# EAGLE design Rev 1 (EAGLE 7.2.0)
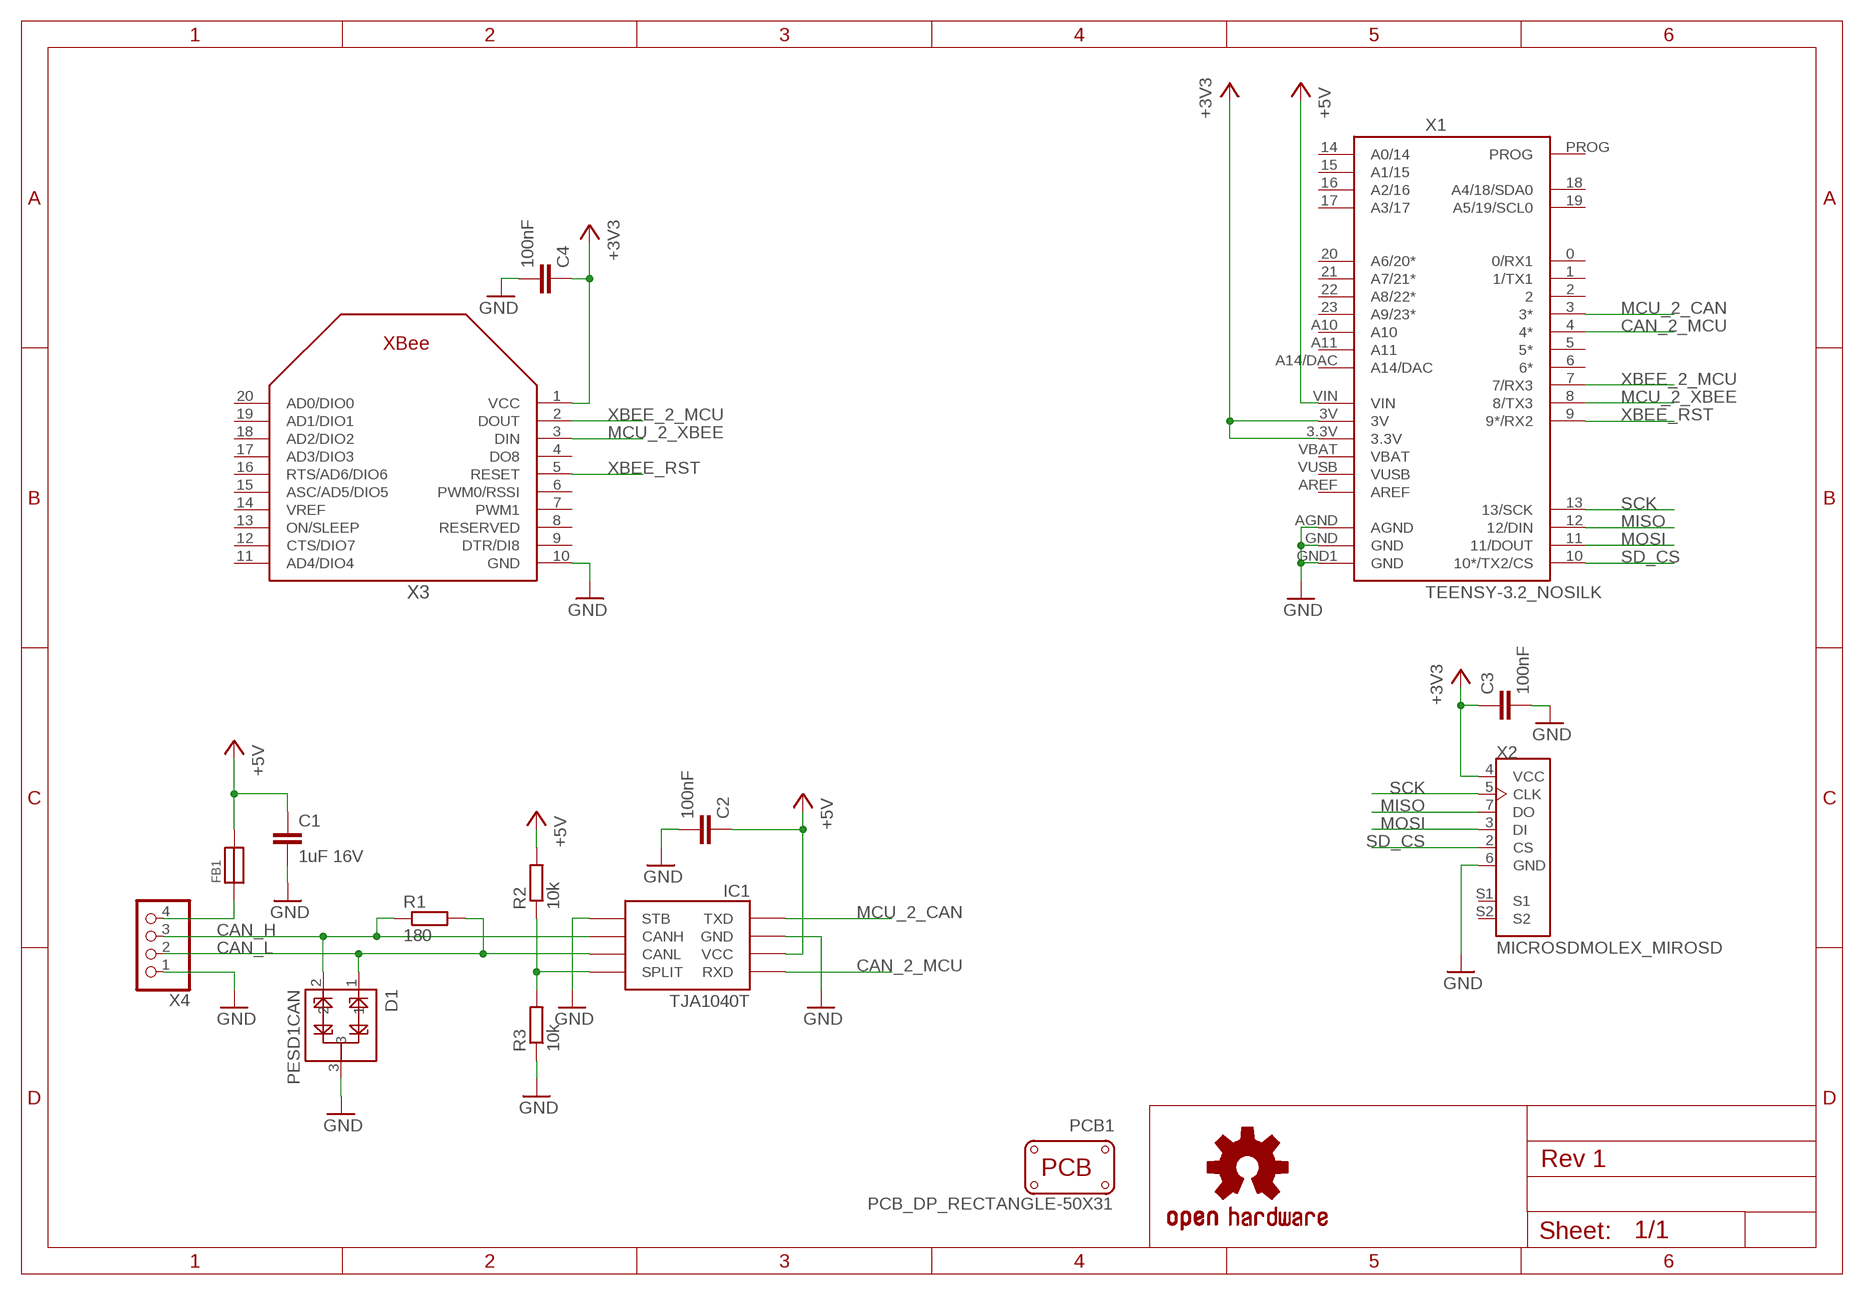
[diagram p0: schematic, sheet 1]

## Parts
C1  1uF 16V  C-EUC1206  [C1206]
C2  100nF  C-EUC0603  [C0603]
C3  100nF  C-EUC0603  [C0603]
C4  100nF  C-EUC0603  [C0603]
D1  PESD1CAN  [SOT23-3]
FB1  FERRITE  [0603]
IC1  TJA1040T  TJA1040  [SO08]
LOGO1  OSHW-LOGOM  [OSHW-LOGO-M]
PCB1  PCB_DP_RECTANGLE-50X31  [DP5031_V1]
R1  180  R-EU_R0603  [R0603]
R2  10k  R-EU_R0603  [R0603]
R3  10k  R-EU_R0603  [R0603]
X1  TEENSY-3.2_NOSILK  TEENSY-3.1NOSILK  [TEENSY-3.1_NOSILK]
X2  MICROSDMOLEX_MIROSD  [MOLEX_MICROSD]
X3  XBEE  [XBEE]
X4  JST_4PIN  [JSTPH4]

## Nets
+3V3: C3.1 C4.1 X1.3.3V X1.3V X2.4(VCC) X3.1(VCC)
+5V: C1.1 C2.1 FB1.2 IC1.3(VCC) R2.2 X1.VIN
+5V_RAW: FB1.1 X4.4
CAN_2_MCU: IC1.4(RXD) X1.4(4*)
CAN_H: D1.2 IC1.7(CANH) R1.1 X4.3
CAN_L: D1.1 IC1.6(CANL) R1.2 X4.2
GND: C1.2 C2.2 C3.2 C4.2 D1.3 IC1.2(GND) IC1.8(STB) R3.1 X1.AGND X1.GND X1.GND1(GND) X2.6(GND) X3.10(GND) X4.1
MCU_2_CAN: IC1.1(TXD) X1.3(3*)
MCU_2_XBEE: X1.8(8/TX3) X3.3(DIN)
MISO: X1.12(12/DIN) X2.7(DO)
MOSI: X1.11(11/DOUT) X2.3(DI)
N$1: IC1.5(SPLIT) R2.1 R3.2
SCK: X1.13(13/SCK) X2.5(CLK)
SD_CS: X1.10(10*/TX2/CS) X2.2(CS)
XBEE_2_MCU: X1.7(7/RX3) X3.2(DOUT)
XBEE_RST: X1.9(9*/RX2) X3.5(RESET)
Unconnected: X1.0(0/RX1) X1.1(1/TX1) X1.2 X1.5(5*) X1.6(6*) X1.14(A0/14) X1.15(A1/15) X1.16(A2/16) X1.17(A3/17) X1.18(A4/18/SDA0) X1.19(A5/19/SCL0) X1.20(A6/20*) X1.21(A7/21*) X1.22(A8/22*) X1.23(A9/23*) X1.A10 X1.A11 X1.A14/DAC X1.AREF X1.PROG X1.VBAT X1.VUSB X2.S1 X2.S2 X3.4(DO8) X3.6(PWM0/RSSI) X3.7(PWM1) X3.8(RESERVED) X3.9(DTR/DI8) X3.11(AD4/DIO4) X3.12(CTS/DIO7) X3.13(ON/SLEEP) X3.14(VREF) X3.15(ASC/AD5/DIO5) X3.16(RTS/AD6/DIO6) X3.17(AD3/DIO3) X3.18(AD2/DIO2) X3.19(AD1/DIO1) X3.20(AD0/DIO0)

## Library data of the parts
C1-C4 = rcl:C-EU: CAPACITOR, European symbol
D1 = SparkFun-DiscreteSemi:PESD1CAN: PESD1CAN is used to protect two automotive CAN bus lines from ESD.; PROD_ID: DIO-12501
FB1 = microbuilder:FERRITE: Ferrite Bead 0603 MMZ1608B121C - 120 Ohm, 600mA Ferrite Chip - Digikey: 445-2164-1-ND BK1608HW121-T - 120 Ohm, 600mA Ferrite Chip - Digikey: 587-1876-2-ND
IC1 = SparkFun-DigitalIC:TJA1040: CAN Tranceiver
LOGO1 = SparkFun-Aesthetics:OSHW-LOGO: Open Source Hardware Logo This logo indicates the piece of hardware it is found on incorporates a OSHW license and/or adheres to the definition of open source hardware found here: http://freedomdefined.org/OSHW
PCB1 = dp_devices:PCB_DP_RECTANGLE: Dangerous Prototypes Standard Rectangular PCB sizes
R1-R3 = rcl:R-EU_: RESISTOR, European symbol
X1 = SparkFun-Boards:TEENSY-3.1; SF_ID: DEV-12646
X2 = mbed-connectors:MICROSD
X3 = adafruit:XBEE
X4 = microbuilder:JST_4PIN: JST 4-Pin Right-Angle Connector 4UConnector: 17312

## Board
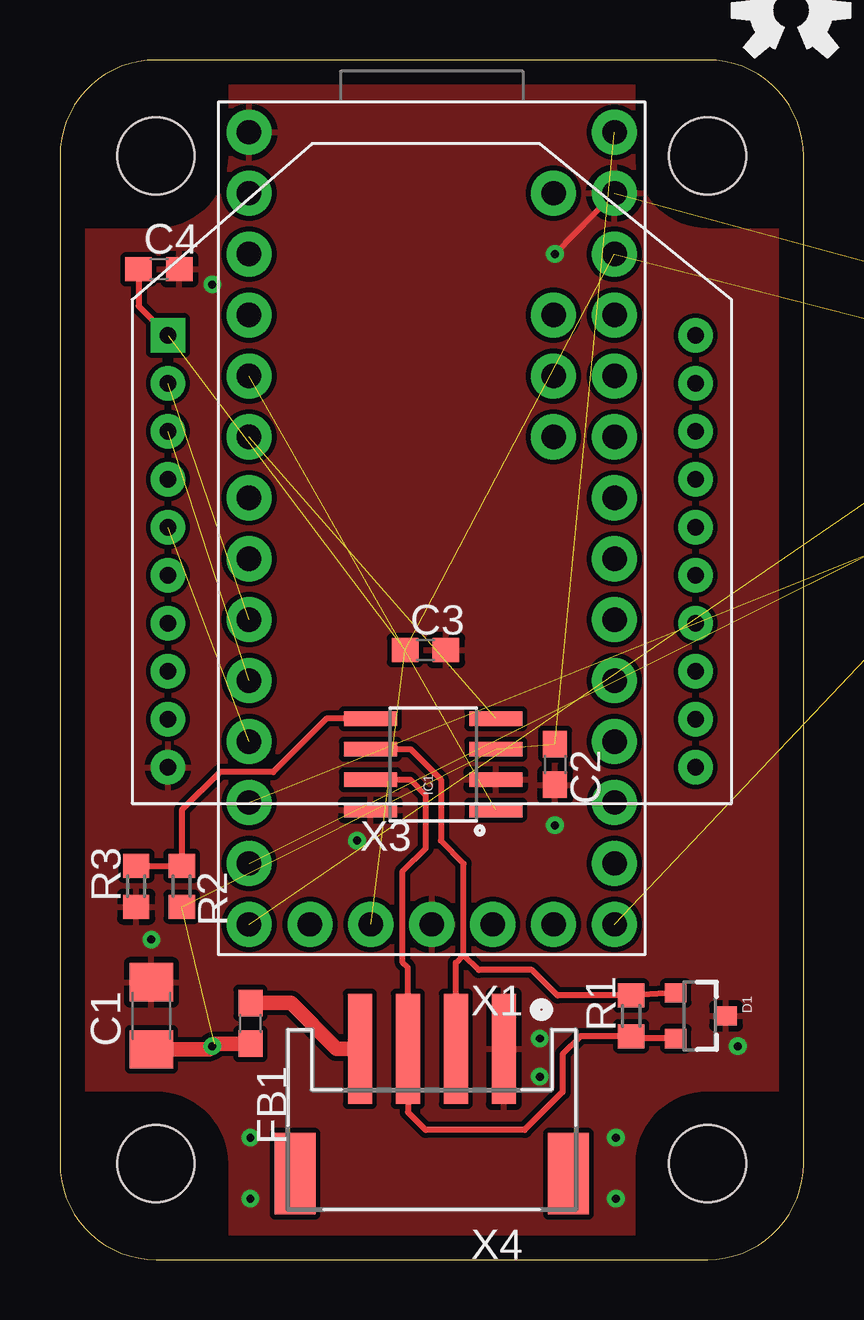
[diagram p1: board, top side]
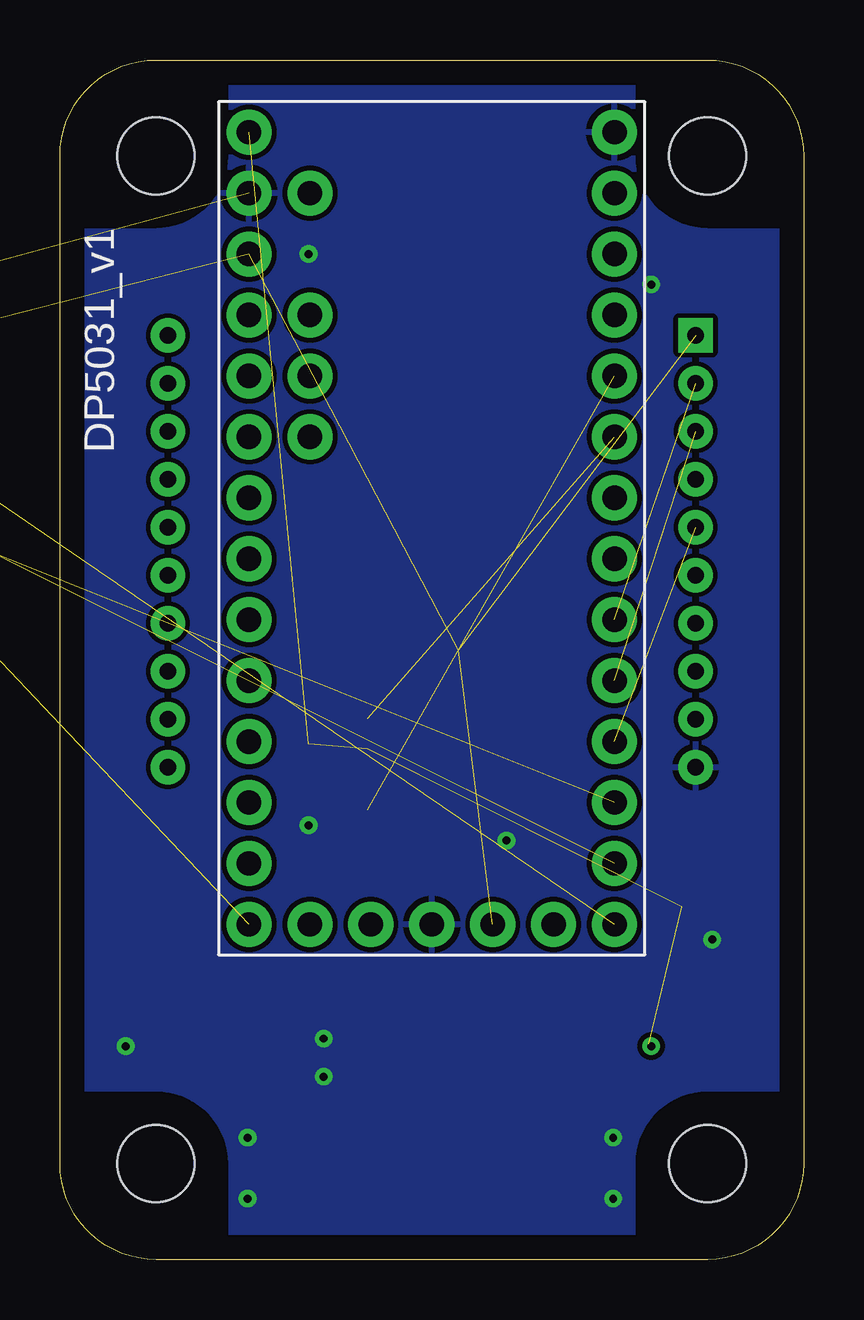
[diagram p2: board, bottom side, seen from below]

Size 31 x 50 mm. Coordinates in mm from the lower left corner, seen from the top.
Copper layers (1*16): Top 0.035mm / dielectric 1.5mm / Bottom 0.035mm
Design rules "default": minimum track width 10mil, minimum drill 24mil, track to track 8mil, track to pad 8mil, pad to pad 8mil, via to via 8mil, smd to smd 8mil, copper to edge 40mil, drill to drill 8mil, minimum pad ring 10mil, minimum via ring 8mil, stop-mask expansion 4mil, vias tented up to drill 0mil, thermal gap 10mil

### Footprints (pad centres in the part's own frame; a part is rotated, then mirrored left to right if it is on the bottom)
C1206 = smd 1.6 x 1.8: 1 -1.4,0; 2 1.4,0
C0603 = smd 1.1 x 1: 1 -0.85,0; 2 0.85,0
SOT23-3 = smd 0.8 x 0.9: 1 -0.95,-1; 2 0.95,-1; 3 0,1.1
0603 = smd 1.1 x 1: 1 -0.85,0; 2 0.85,0
SO08 = smd 0.61 x 2.21: 1 -1.905,-2.616; 2 -0.635,-2.616; 3 0.635,-2.616; 4 1.905,-2.616; 5 1.905,2.616; 6 0.635,2.616; 7 -0.635,2.616; 8 -1.905,2.616
DP5031_V1 = hole 3.2: 4,4; 46,4; 46,27; 4,27
R0603 = smd 1 x 1.1: 1 -0.85,0; 2 0.85,0
TEENSY-3.1_NOSILK = drill 1.016 pad 1.88: 0 16.51,3.81; 1 16.51,6.35; 2 16.51,8.89; 3 16.51,11.43; 3.3V 11.43,34.29; 3V 1.27,6.35; 4 16.51,13.97; 5 16.51,16.51; 6 16.51,19.05; 7 16.51,21.59; 8 16.51,24.13; 9 16.51,26.67; 10 16.51,29.21; 11 16.51,31.75; 12 16.51,34.29; 13 1.27,34.29; 14 1.27,31.75; 15 1.27,29.21; 16 1.27,26.67; 17 1.27,24.13; 18 1.27,21.59; 19 1.27,19.05; 20 1.27,16.51; 21 1.27,13.97; 22 1.27,11.43; 23 1.27,8.89; A10 3.81,11.43; A11 3.81,13.97; A14/DAC 3.81,34.29; AGND 1.27,3.81; AREF 3.81,8.89; GND 8.89,34.29; GND1 16.51,1.27; PROG 6.35,34.29; VBAT 13.97,34.29; VIN 1.27,1.27; VUSB 3.81,3.81
MOLEX_MICROSD = smd 0.8 x 1.8: 1 -3.89,10.66; 2 -2.79,10.66; 3 -1.69,10.66; 4 -0.59,10.66; 5 0.51,10.66; 6 1.61,10.66; 7 2.71,10.66; 8 3.81,10.66 | smd 1.7 x 2.2: M1 5.8,-4.14; M5 -8.8,-5.14 | smd 1.6 x 1.55: M2 -5.99,10.185 | smd 1.7 x 3.4: M3 -9.5,9.06 | smd 1.7 x 3.6: M4 -9.5,-0.49 | smd 1.55 x 2.1: S1 5.8,0.46 | smd 1.55 x 2.8: S2 5.8,8.16
XBEE = drill 0.7 pad 1.422 square: 1 -11,5.5 | drill 0.7 pad 1.422: 2 -11,3.5; 3 -11,1.5; 4 -11,-0.5; 5 -11,-2.5; 6 -11,-4.5; 7 -11,-6.5; 8 -11,-8.5; 9 -11,-10.5; 10 -11,-12.5; 11 11,-12.5; 12 11,-10.5; 13 11,-8.5; 14 11,-6.5; 15 11,-4.5; 16 11,-2.5; 17 11,-0.5; 18 11,1.5; 19 11,3.5; 20 11,5.5
JSTPH4 = smd 1 x 4.6: 1 -3,-3.7; 2 -1,-3.7; 3 1,-3.7; 4 3,-3.7 | smd 1.7 x 3.4: NC1 -5.7,1.5; NC2 5.7,1.5

### Placement (x,y rotation side)
C1  3.81,10.16 90 top
C2  20.64,20.64 270 top
C3  15.24,25.4 0 top
C4  4.13,41.27 0 top
D1  26.67,10.16 270 top
FB1  7.94,9.84 270 top
IC1  15.56,20.64 90 top
LOGO1  30.48,52.07 0 top
PCB1  31,0 90 top
R1  23.81,10.16 90 top
R2  5.08,15.56 270 top
R3  3.17,15.56 90 top
X1  24.39,48.26 180 top
X2  55.88,36.83 90 top  (outside the outline)
X3  15.5,33.02 0 top
X4  15.5,5.08 180 top

### Tracks (layer width: path | path; a pad name or v marks a point on that pad's centre or on a via)
+3V3  (4 unrouted)
  Top 0.254: C4.1 3.28,39.74 X3.1
+5V  (via drill 0.33)  (4 unrouted)
  Top 0.61: C1.1 6.22,8.76 v6.35,8.89 6.45,8.99 FB1.2
+5V_RAW
  Top 0.61: X4.4 11.54,8.78 9.63,10.69 FB1.1
CAN_2_MCU  (1 unrouted)
CAN_H
  Top 0.254: IC1.7 14.61,20 15.24,19.37 15.24,17.14 14.29,16.19 14.29,12.38 14.5,12.17 X4.3 14.5,6.14 15.24,5.4 19.37,5.4 20.95,6.99 20.95,8.57 21.69,9.31 R1.1 23.91,9.21 D1.2
CAN_L
  Top 0.254: X4.2 16.5,12.37 16.83,12.7 | 16.83,12.7 16.83,16.51 15.88,17.46 15.88,20 14.61,21.27 IC1.6 | D1.1 R1.2 20.74,11.01 19.68,12.06 17.46,12.06 16.83,12.7
GND  (via drill 0.33)  (1 unrouted)
  Top 0.254: X1.AGND v20.64,41.91
  other vias: 23.18,2.54 23.18,5.08 7.94,5.08 7.94,2.54 3.81,13.34 12.38,17.46 20.64,18.1 6.35,40.64 20,9.21 20,7.62 28.26,8.89
  pour Top (rank 5): 0,0 31,0 31,50 0,50
  pour Bottom (rank 5): 0,0 31,0 31,50 0,50
MCU_2_CAN  (1 unrouted)
MCU_2_XBEE  (1 unrouted)
MISO  (1 unrouted)
MOSI  (1 unrouted)
N$1
  Top 0.254: R3.2 R2.1 5.08,18.73 6.67,20.32 8.89,20.32 11.11,22.54 IC1.5
SCK  (1 unrouted)
SD_CS  (1 unrouted)
XBEE_2_MCU  (1 unrouted)
XBEE_RST  (1 unrouted)